# Altium schematic sheet IO.SchDoc
size A4
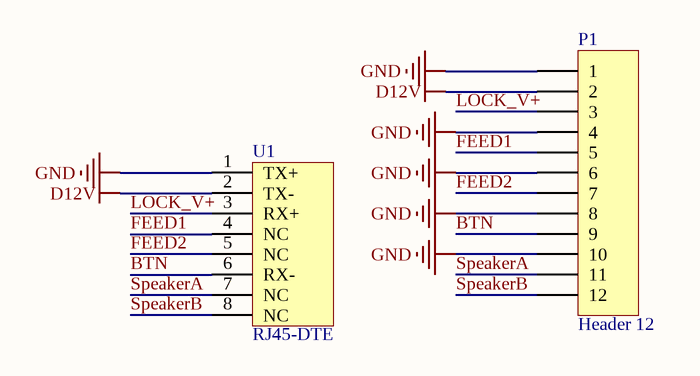
[diagram p0: IO.SchDoc]

## Parts
P1  Header 12  [KF141R-2.54-12]
U1  RJ45-DTE  [RJ45]

## Nets
D12V: P1.2 U1.2(TX-)
GND: P1.1 P1.4 P1.6 P1.8 P1.10 U1.1(TX+)
BTN: P1.9 U1.6(RX-)
FEED1: P1.5 U1.4(NC)
FEED2: P1.7 U1.5(NC)
LOCK_V+: P1.3 U1.3(RX+)
SpeakerA: P1.11 U1.7(NC)
SpeakerB: P1.12 U1.8(NC)

## Library data of the parts
P1 = Header 12: Header, 12-Pin; LatestRevisionDate: 17-Jul-2002; LatestRevisionNote: Re-released for DXP Platform.; Publisher: Altium Limited